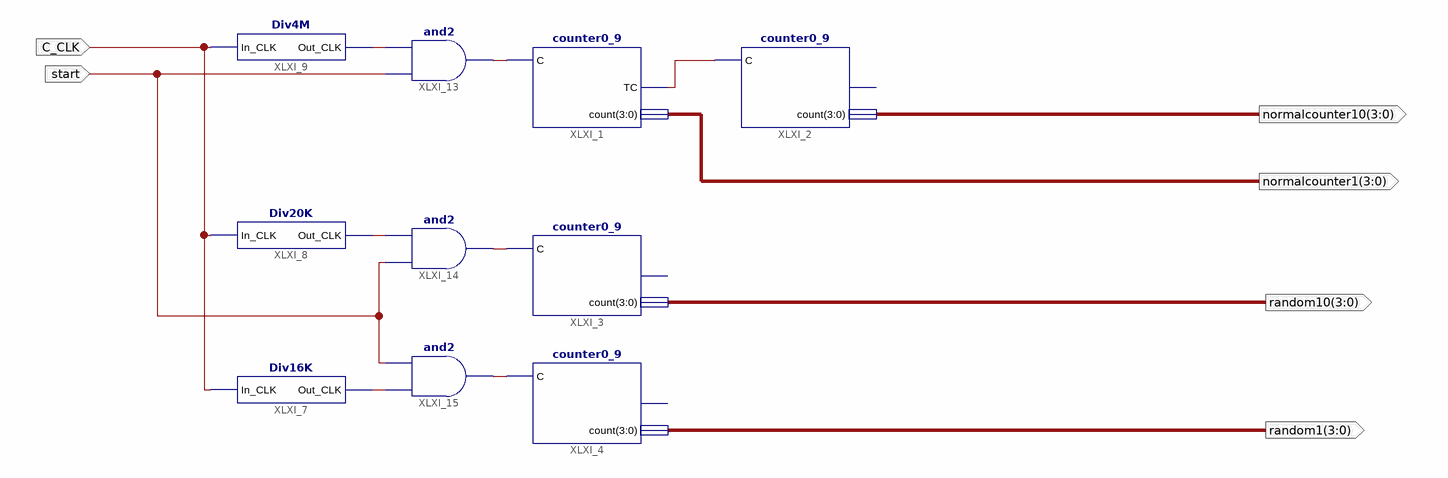
[diagram p0: schematic sheet 1]
// Xilinx ISE schematic counter.sch (spartan6) as structural Verilog: 10 symbols, 6 ports
module counter (
  input  start,
  input  C_CLK,
  output [3:0] normalcounter10,
  output [3:0] normalcounter1,
  output [3:0] random10,
  output [3:0] random1
);

  wire XLXN_1, XLXN_13, XLXN_14, XLXN_15, XLXN_17, XLXN_18, XLXN_19;

  counter0_9 XLXI_1 (.C(XLXN_13), .TC(XLXN_1), .count(normalcounter1));
  counter0_9 XLXI_2 (.C(XLXN_1), .count(normalcounter10));  // open: TC
  counter0_9 XLXI_3 (.C(XLXN_14), .count(random10));  // open: TC
  counter0_9 XLXI_4 (.C(XLXN_15), .count(random1));  // open: TC
  and XLXI_13 (XLXN_13, start, XLXN_19);
  and XLXI_14 (XLXN_14, start, XLXN_17);
  and XLXI_15 (XLXN_15, XLXN_18, start);
  Div4M XLXI_9 (.In_CLK(C_CLK), .Out_CLK(XLXN_19));
  Div20K XLXI_8 (.In_CLK(C_CLK), .Out_CLK(XLXN_17));
  Div16K XLXI_7 (.In_CLK(C_CLK), .Out_CLK(XLXN_18));
endmodule
